# EAGLE schematic tf328 (EAGLE 8.2.2)

## Sheet 1 of 4
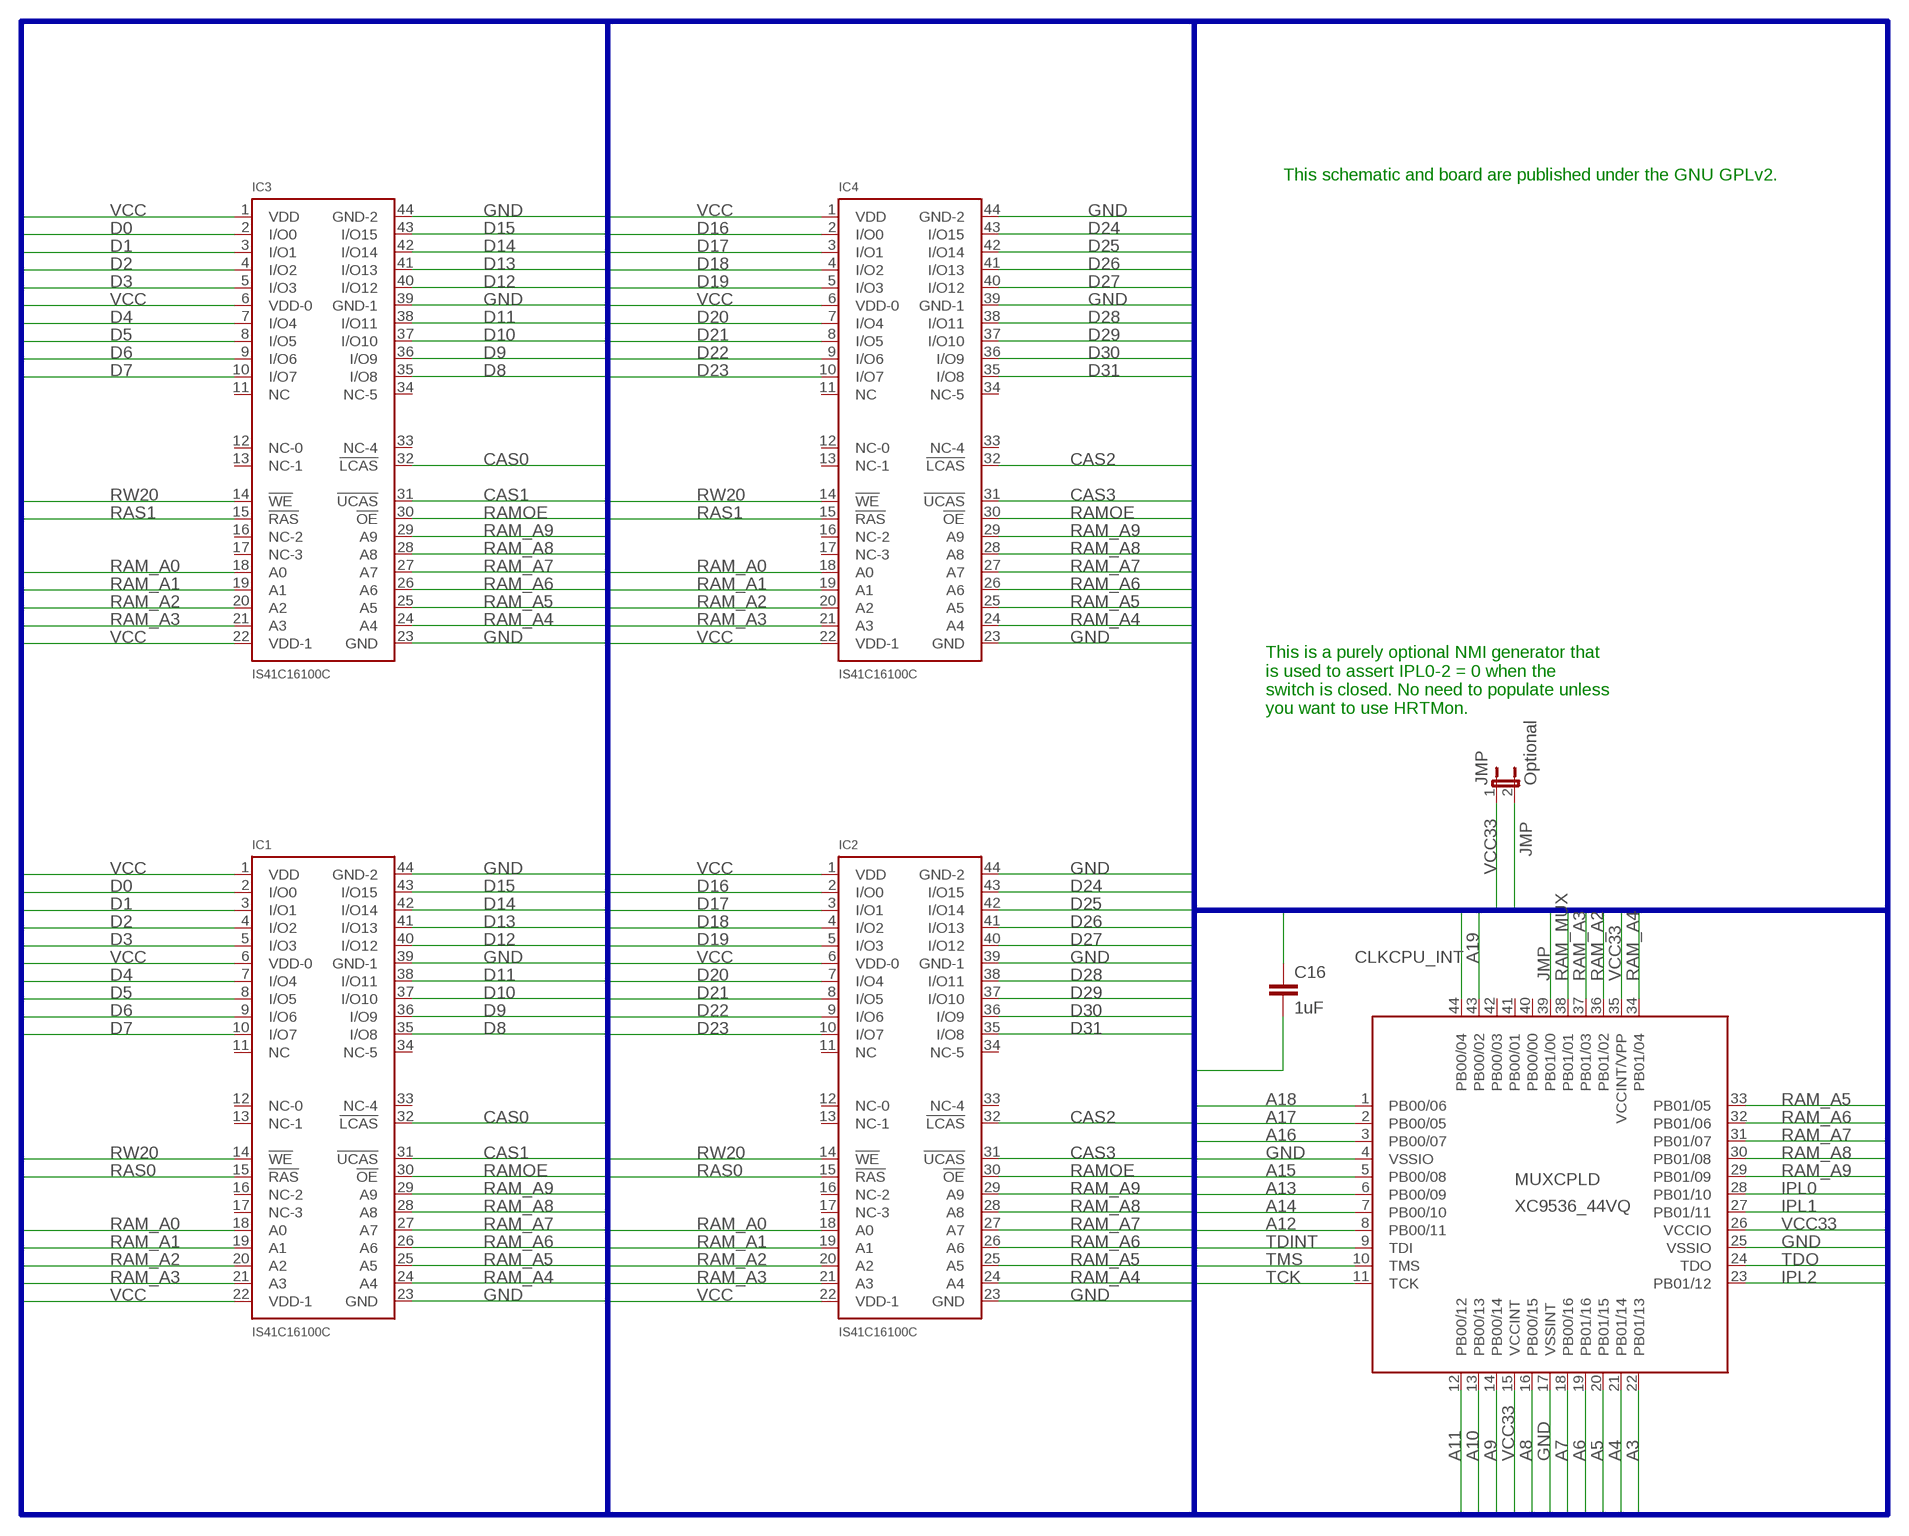
[diagram p0: schematic, sheet 1]

### Parts
C16  1uF  CC0603  [C0603]
IC1  IS41C16100C  [TSOP44(50)-II]
IC2  IS41C16100C  [TSOP44(50)-II]
IC3  IS41C16100C  [TSOP44(50)-II]
IC4  IS41C16100C  [TSOP44(50)-II]
JMP  Optional  JUMPER-2PTH  [1X02]
MUXCPLD  XC9536_44VQ  [SQFP-S-10X10-44]

### Nets
A3: MUXCPLD.22(PB01/13) ; also sheet 2,3,4
A4: MUXCPLD.21(PB01/14) ; also sheet 2,3,4
A5: MUXCPLD.20(PB01/15) ; also sheet 2,4
A6: MUXCPLD.19(PB01/16) ; also sheet 2,4
A7: MUXCPLD.18(PB00/16) ; also sheet 2
A8: MUXCPLD.16(PB00/15) ; also sheet 2
A9: MUXCPLD.14(PB00/14) ; also sheet 2
A10: MUXCPLD.13(PB00/13) ; also sheet 2
A11: MUXCPLD.12(PB00/12) ; also sheet 2
A12: MUXCPLD.8(PB00/11) ; also sheet 2,4
A13: MUXCPLD.6(PB00/09) ; also sheet 2,4
A14: MUXCPLD.7(PB00/10) ; also sheet 2
A15: MUXCPLD.5(PB00/08) ; also sheet 2,4
A16: MUXCPLD.3(PB00/07) ; also sheet 2,4
A17: MUXCPLD.2(PB00/05) ; also sheet 2,4
A18: MUXCPLD.1(PB00/06) ; also sheet 2,4
A19: MUXCPLD.43(PB00/02) ; also sheet 2,4
CAS0: IC1.32(!LCAS) IC3.32(!LCAS) ; also sheet 4
CAS1: IC1.31(!UCAS) IC3.31(!UCAS) ; also sheet 4
CAS2: IC2.32(!LCAS) IC4.32(!LCAS) ; also sheet 4
CAS3: IC2.31(!UCAS) IC4.31(!UCAS) ; also sheet 4
CLKCPU_INT: MUXCPLD.44(PB00/04) ; also sheet 4
D0: IC1.2(I/O0) IC3.2(I/O0) ; also sheet 2
D1: IC1.3(I/O1) IC3.3(I/O1) ; also sheet 2
D2: IC1.4(I/O2) IC3.4(I/O2) ; also sheet 2
D3: IC1.5(I/O3) IC3.5(I/O3) ; also sheet 2
D4: IC1.7(I/O4) IC3.7(I/O4) ; also sheet 2
D5: IC1.8(I/O5) IC3.8(I/O5) ; also sheet 2
D6: IC1.9(I/O6) IC3.9(I/O6) ; also sheet 2
D7: IC1.10(I/O7) IC3.10(I/O7) ; also sheet 2
D8: IC1.35(I/O8) IC3.35(I/O8) ; also sheet 2
D9: IC1.36(I/O9) IC3.36(I/O9) ; also sheet 2
D10: IC1.37(I/O10) IC3.37(I/O10) ; also sheet 2
D11: IC1.38(I/O11) IC3.38(I/O11) ; also sheet 2
D12: IC1.40(I/O12) IC3.40(I/O12) ; also sheet 2
D13: IC1.41(I/O13) IC3.41(I/O13) ; also sheet 2
D14: IC1.42(I/O14) IC3.42(I/O14) ; also sheet 2
D15: IC1.43(I/O15) IC3.43(I/O15) ; also sheet 2
D16: IC2.2(I/O0) IC4.2(I/O0) ; also sheet 2,3
D17: IC2.3(I/O1) IC4.3(I/O1) ; also sheet 2,3
D18: IC2.4(I/O2) IC4.4(I/O2) ; also sheet 2,3
D19: IC2.5(I/O3) IC4.5(I/O3) ; also sheet 2,3
D20: IC2.7(I/O4) IC4.7(I/O4) ; also sheet 2,3
D21: IC2.8(I/O5) IC4.8(I/O5) ; also sheet 2,3
D22: IC2.9(I/O6) IC4.9(I/O6) ; also sheet 2,3
D23: IC2.10(I/O7) IC4.10(I/O7) ; also sheet 2,3
D24: IC2.43(I/O15) IC4.43(I/O15) ; also sheet 2,3,4
D25: IC2.42(I/O14) IC4.42(I/O14) ; also sheet 2,3,4
D26: IC2.41(I/O13) IC4.41(I/O13) ; also sheet 2,3,4
D27: IC2.40(I/O12) IC4.40(I/O12) ; also sheet 2,3,4
D28: IC2.38(I/O11) IC4.38(I/O11) ; also sheet 2,3,4
D29: IC2.37(I/O10) IC4.37(I/O10) ; also sheet 2,3,4
D30: IC2.36(I/O9) IC4.36(I/O9) ; also sheet 2,3,4
D31: IC2.35(I/O8) IC4.35(I/O8) ; also sheet 2,3,4
GND: C16.2 IC1.23(GND) IC1.39(GND-1) IC1.44(GND-2) IC2.23(GND) IC2.39(GND-1) IC2.44(GND-2) IC3.23(GND) IC3.39(GND-1) IC3.44(GND-2) IC4.23(GND) IC4.39(GND-1) IC4.44(GND-2) MUXCPLD.4(VSSIO) MUXCPLD.17(VSSINT) MUXCPLD.25(VSSIO) ; also sheet 2,3,4
IPL0: MUXCPLD.28(PB01/10) ; also sheet 2
IPL1: MUXCPLD.27(PB01/11) ; also sheet 2
IPL2: MUXCPLD.23(PB01/12) ; also sheet 2
JMP: JMP.2 MUXCPLD.39(PB01/00)
RAM_A0: IC1.18(A0) IC2.18(A0) IC3.18(A0) IC4.18(A0) ; also sheet 4
RAM_A1: IC1.19(A1) IC2.19(A1) IC3.19(A1) IC4.19(A1) ; also sheet 4
RAM_A2: IC1.20(A2) IC2.20(A2) IC3.20(A2) IC4.20(A2) MUXCPLD.36(PB01/02)
RAM_A3: IC1.21(A3) IC2.21(A3) IC3.21(A3) IC4.21(A3) MUXCPLD.37(PB01/03)
RAM_A4: IC1.24(A4) IC2.24(A4) IC3.24(A4) IC4.24(A4) MUXCPLD.34(PB01/04)
RAM_A5: IC1.25(A5) IC2.25(A5) IC3.25(A5) IC4.25(A5) MUXCPLD.33(PB01/05)
RAM_A6: IC1.26(A6) IC2.26(A6) IC3.26(A6) IC4.26(A6) MUXCPLD.32(PB01/06)
RAM_A7: IC1.27(A7) IC2.27(A7) IC3.27(A7) IC4.27(A7) MUXCPLD.31(PB01/07)
RAM_A8: IC1.28(A8) IC2.28(A8) IC3.28(A8) IC4.28(A8) MUXCPLD.30(PB01/08)
RAM_A9: IC1.29(A9) IC2.29(A9) IC3.29(A9) IC4.29(A9) MUXCPLD.29(PB01/09)
RAM_MUX: MUXCPLD.38(PB01/01) ; also sheet 4
RAMOE: IC1.30(!OE) IC2.30(!OE) IC3.30(!OE) IC4.30(!OE) ; also sheet 4
RAS0: IC1.15(!RAS) IC2.15(!RAS) ; also sheet 4
RAS1: IC3.15(!RAS) IC4.15(!RAS) ; also sheet 4
RW20: IC1.14(!WE) IC2.14(!WE) IC3.14(!WE) IC4.14(!WE) ; also sheet 2,4
TCK: MUXCPLD.11(TCK) ; also sheet 4
TDINT: MUXCPLD.9(TDI) ; also sheet 4
TDO: MUXCPLD.24(TDO) ; also sheet 4
TMS: MUXCPLD.10(TMS) ; also sheet 4
VCC: IC1.1(VDD) IC1.6(VDD-0) IC1.22(VDD-1) IC2.1(VDD) IC2.6(VDD-0) IC2.22(VDD-1) IC3.1(VDD) IC3.6(VDD-0) IC3.22(VDD-1) IC4.1(VDD) IC4.6(VDD-0) IC4.22(VDD-1) ; also sheet 2,3,4
VCC33: C16.1 JMP.1 MUXCPLD.15(VCCINT) MUXCPLD.26(VCCIO) MUXCPLD.35(VCCINT/VPP) ; also sheet 4
Unconnected: IC1.11(NC) IC1.12(NC-0) IC1.13(NC-1) IC1.16(NC-2) IC1.17(NC-3) IC1.33(NC-4) IC1.34(NC-5) IC2.11(NC) IC2.12(NC-0) IC2.13(NC-1) IC2.16(NC-2) IC2.17(NC-3) IC2.33(NC-4) IC2.34(NC-5) IC3.11(NC) IC3.12(NC-0) IC3.13(NC-1) IC3.16(NC-2) IC3.17(NC-3) IC3.33(NC-4) IC3.34(NC-5) IC4.11(NC) IC4.12(NC-0) IC4.13(NC-1) IC4.16(NC-2) IC4.17(NC-3) IC4.33(NC-4) IC4.34(NC-5) MUXCPLD.40(PB00/00) MUXCPLD.41(PB00/01) MUXCPLD.42(PB00/03)

### Buses
VCC33,VCC,GND,RW20,D[0..31],RAM_A[0..9],RAM_CAS[0..1],RAMOE,A[0..23],RAM_MUX,RAS[0..1],CAS[0..3],TCK,TMS,TDI,TDO,TDINT,CLKCPU_INT,AS20,DS20,IPL[0..2],JMP

### Notes on the sheet
- This schematic and board are published under the GNU GPLv2.
- This is a purely optional NMI generator that 
  is used to assert IPL0-2 = 0 when the
  switch is closed. No need to populate unless
  you want to use HRTMon.

## Sheet 2 of 4
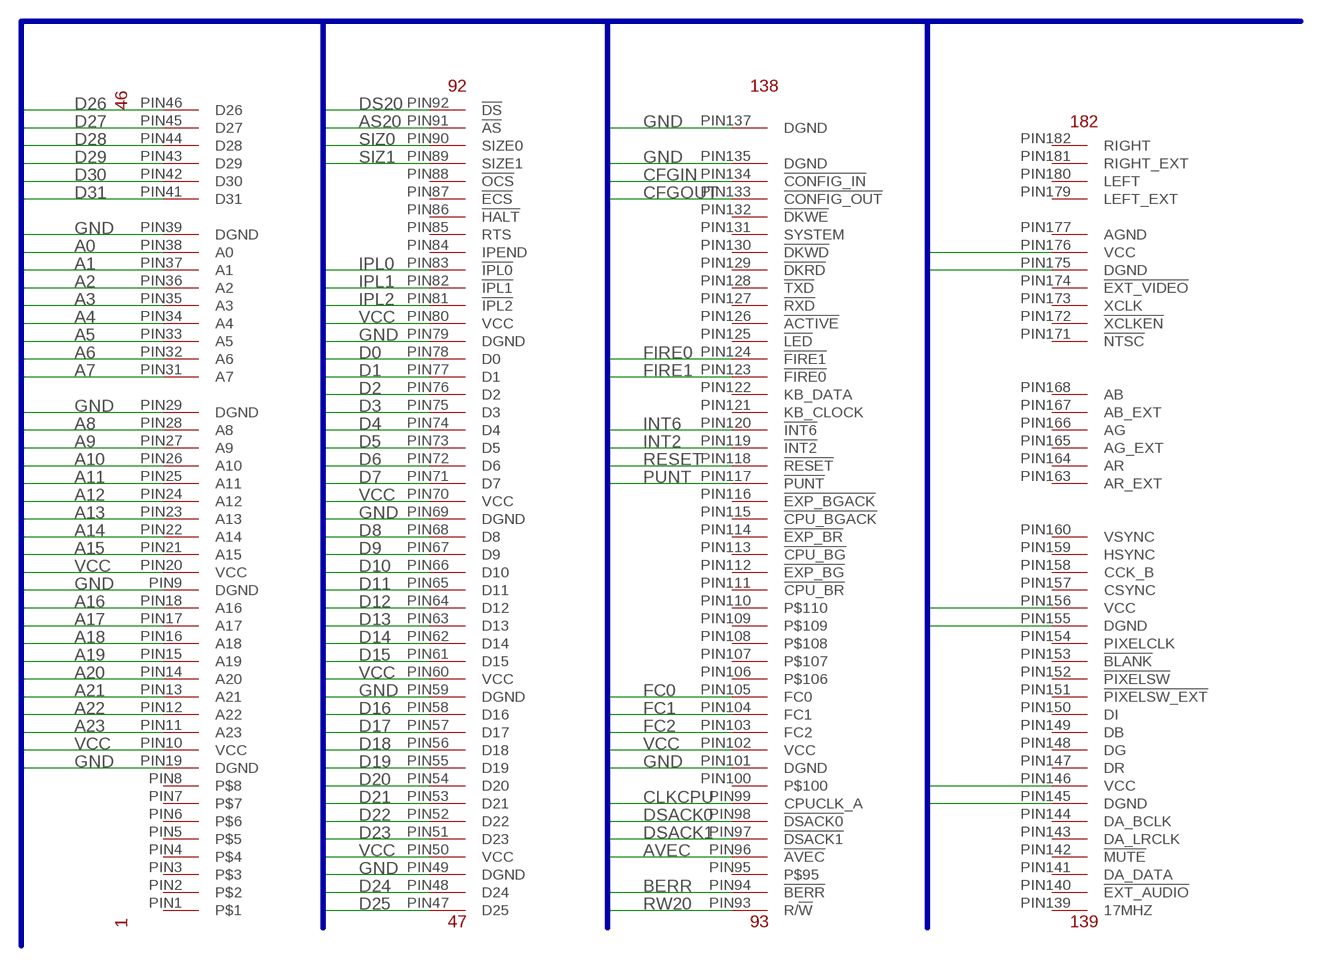
[diagram p1: schematic, sheet 2]

### Parts
CONN1  MCA_CONN_182  [MCA_CONN_182]

### Nets
A0: CONN1.PIN38(A0) ; also sheet 4
A1: CONN1.PIN37(A1) ; also sheet 4
A2: CONN1.PIN36(A2) ; also sheet 3,4
A3: CONN1.PIN35(A3) ; also sheet 1,3,4
A4: CONN1.PIN34(A4) ; also sheet 1,3,4
A5: CONN1.PIN33(A5) ; also sheet 1,4
A6: CONN1.PIN32(A6) ; also sheet 1,4
A7: CONN1.PIN31(A7) ; also sheet 1
A8: CONN1.PIN28(A8) ; also sheet 1
A9: CONN1.PIN27(A9) ; also sheet 1
A10: CONN1.PIN26(A10) ; also sheet 1
A11: CONN1.PIN25(A11) ; also sheet 1
A12: CONN1.PIN24(A12) ; also sheet 1,4
A13: CONN1.PIN23(A13) ; also sheet 1,4
A14: CONN1.PIN22(A14) ; also sheet 1
A15: CONN1.PIN21(A15) ; also sheet 1,4
A16: CONN1.PIN18(A16) ; also sheet 1,4
A17: CONN1.PIN17(A17) ; also sheet 1,4
A18: CONN1.PIN16(A18) ; also sheet 1,4
A19: CONN1.PIN15(A19) ; also sheet 1,4
A20: CONN1.PIN14(A20) ; also sheet 4
A21: CONN1.PIN13(A21) ; also sheet 4
A22: CONN1.PIN12(A22) ; also sheet 4
A23: CONN1.PIN11(A23) ; also sheet 4
AS20: CONN1.PIN91(!AS) ; also sheet 4
AVEC: CONN1.PIN96(!AVEC)
BERR: CONN1.PIN94(!BERR)
CFGIN: CONN1.PIN134(!CONFIG_IN)
CFGOUT: CONN1.PIN133(!CONFIG_OUT)
CLKCPU: CONN1.PIN99(CPUCLK_A) ; also sheet 4
D0: CONN1.PIN78(D0) ; also sheet 1
D1: CONN1.PIN77(D1) ; also sheet 1
D2: CONN1.PIN76(D2) ; also sheet 1
D3: CONN1.PIN75(D3) ; also sheet 1
D4: CONN1.PIN74(D4) ; also sheet 1
D5: CONN1.PIN73(D5) ; also sheet 1
D6: CONN1.PIN72(D6) ; also sheet 1
D7: CONN1.PIN71(D7) ; also sheet 1
D8: CONN1.PIN68(D8) ; also sheet 1
D9: CONN1.PIN67(D9) ; also sheet 1
D10: CONN1.PIN66(D10) ; also sheet 1
D11: CONN1.PIN65(D11) ; also sheet 1
D12: CONN1.PIN64(D12) ; also sheet 1
D13: CONN1.PIN63(D13) ; also sheet 1
D14: CONN1.PIN62(D14) ; also sheet 1
D15: CONN1.PIN61(D15) ; also sheet 1
D16: CONN1.PIN58(D16) ; also sheet 1,3
D17: CONN1.PIN57(D17) ; also sheet 1,3
D18: CONN1.PIN56(D18) ; also sheet 1,3
D19: CONN1.PIN55(D19) ; also sheet 1,3
D20: CONN1.PIN54(D20) ; also sheet 1,3
D21: CONN1.PIN53(D21) ; also sheet 1,3
D22: CONN1.PIN52(D22) ; also sheet 1,3
D23: CONN1.PIN51(D23) ; also sheet 1,3
D24: CONN1.PIN48(D24) ; also sheet 1,3,4
D25: CONN1.PIN47(D25) ; also sheet 1,3,4
D26: CONN1.PIN46(D26) ; also sheet 1,3,4
D27: CONN1.PIN45(D27) ; also sheet 1,3,4
D28: CONN1.PIN44(D28) ; also sheet 1,3,4
D29: CONN1.PIN43(D29) ; also sheet 1,3,4
D30: CONN1.PIN42(D30) ; also sheet 1,3,4
D31: CONN1.PIN41(D31) ; also sheet 1,3,4
DS20: CONN1.PIN92(!DS) ; also sheet 4
DSACK0: CONN1.PIN98(!DSACK0) ; also sheet 4
DSACK1: CONN1.PIN97(!DSACK1) ; also sheet 4
FC0: CONN1.PIN105(FC0)
FC1: CONN1.PIN104(FC1)
FC2: CONN1.PIN103(FC2)
FIRE0: CONN1.PIN124(!FIRE1)
FIRE1: CONN1.PIN123(!FIRE0)
GND: CONN1.PIN9(DGND) CONN1.PIN19(DGND) CONN1.PIN29(DGND) CONN1.PIN39(DGND) CONN1.PIN49(DGND) CONN1.PIN59(DGND) CONN1.PIN69(DGND) CONN1.PIN79(DGND) CONN1.PIN101(DGND) CONN1.PIN135(DGND) CONN1.PIN137(DGND) CONN1.PIN145(DGND) CONN1.PIN155(DGND) CONN1.PIN175(DGND) ; also sheet 1,3,4
INT2: CONN1.PIN119(!INT2) ; also sheet 4
INT6: CONN1.PIN120(!INT6)
IPL0: CONN1.PIN83(!IPL0) ; also sheet 1
IPL1: CONN1.PIN82(!IPL1) ; also sheet 1
IPL2: CONN1.PIN81(!IPL2) ; also sheet 1
PUNT: CONN1.PIN117(!PUNT) ; also sheet 4
RESET: CONN1.PIN118(!RESET) ; also sheet 3,4
RW20: CONN1.PIN93(R/!W) ; also sheet 1,4
SIZ0: CONN1.PIN90(SIZE0) ; also sheet 4
SIZ1: CONN1.PIN89(SIZE1) ; also sheet 4
VCC: CONN1.PIN10(VCC) CONN1.PIN20(VCC) CONN1.PIN50(VCC) CONN1.PIN60(VCC) CONN1.PIN70(VCC) CONN1.PIN80(VCC) CONN1.PIN102(VCC) CONN1.PIN146(VCC) CONN1.PIN156(VCC) CONN1.PIN176(VCC) ; also sheet 1,3,4
Unconnected: CONN1.PIN1 CONN1.PIN2 CONN1.PIN3 CONN1.PIN4 CONN1.PIN5 CONN1.PIN6 CONN1.PIN7 CONN1.PIN8 CONN1.PIN84(IPEND) CONN1.PIN85(RTS) CONN1.PIN86(!HALT) CONN1.PIN87(!ECS) CONN1.PIN88(!OCS) CONN1.PIN95 CONN1.PIN100 CONN1.PIN106 CONN1.PIN107 CONN1.PIN108 CONN1.PIN109 CONN1.PIN110 CONN1.PIN111(!CPU_BR) CONN1.PIN112(!EXP_BG) CONN1.PIN113(!CPU_BG) CONN1.PIN114(!EXP_BR) CONN1.PIN115(!CPU_BGACK) CONN1.PIN116(!EXP_BGACK) CONN1.PIN121(KB_CLOCK) CONN1.PIN122(KB_DATA) CONN1.PIN125(!LED) CONN1.PIN126(!ACTIVE) CONN1.PIN127(!RXD) CONN1.PIN128(!TXD) CONN1.PIN129(!DKRD) CONN1.PIN130(!DKWD) CONN1.PIN131(SYSTEM) CONN1.PIN132(!DKWE) CONN1.PIN139(17MHZ) CONN1.PIN140(!EXT_AUDIO) CONN1.PIN141(DA_DATA) CONN1.PIN142(!MUTE) CONN1.PIN143(DA_LRCLK) CONN1.PIN144(DA_BCLK) CONN1.PIN147(DR) CONN1.PIN148(DG) CONN1.PIN149(DB) CONN1.PIN150(DI) CONN1.PIN151(!PIXELSW_EXT) CONN1.PIN152(!PIXELSW) CONN1.PIN153(!BLANK) CONN1.PIN154(PIXELCLK) CONN1.PIN157(CSYNC) CONN1.PIN158(CCK_B) CONN1.PIN159(HSYNC) CONN1.PIN160(VSYNC) CONN1.PIN163(AR_EXT) CONN1.PIN164(AR) CONN1.PIN165(AG_EXT) CONN1.PIN166(AG) CONN1.PIN167(AB_EXT) CONN1.PIN168(AB) CONN1.PIN171(!NTSC) CONN1.PIN172(!XCLKEN) CONN1.PIN173(XCLK) CONN1.PIN174(!EXT_VIDEO) CONN1.PIN179(LEFT_EXT) CONN1.PIN180(LEFT) CONN1.PIN181(RIGHT_EXT) CONN1.PIN182(RIGHT)

### Buses
VCC,GND,D[0..31],A[0..31],INT2,INT6,RESET,AS20,DS20,RW20,SIZ[0..1],DSACK[0..1],FC[0..2],CLKCPU,AVEC,BERR,CFGIN,CFGOUT,PUNT,FIRE[0..1],IPL[0..2]

## Sheet 3 of 4
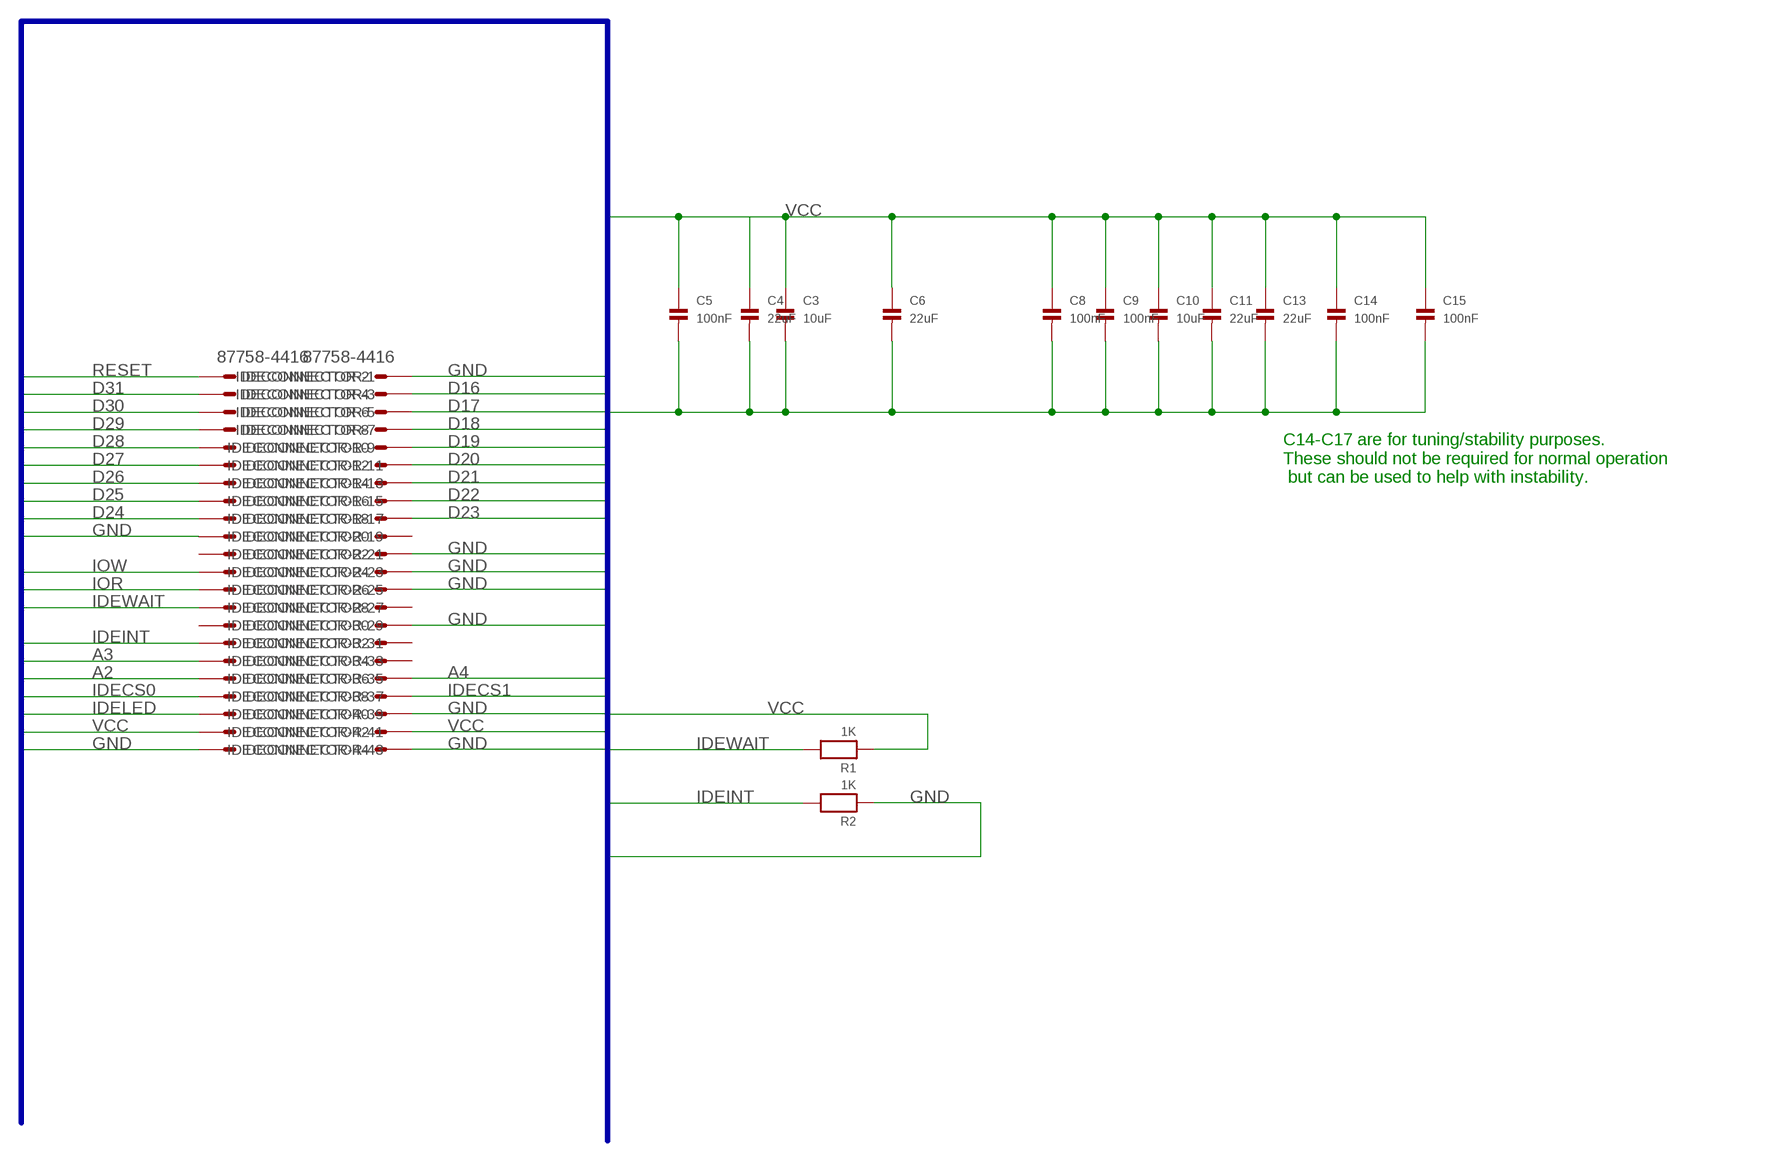
[diagram p2: schematic, sheet 3]

### Parts
C3  10uF  CAP_CERAMIC1206  [1206]
C4  22uF  CAP_CERAMIC1206  [1206]
C5  100nF  CAP_CERAMIC1206  [1206]
C6  22uF  CAP_CERAMIC1206  [1206]
C8  100nF  CAP_CERAMIC1206  [1206]
C9  100nF  CAP_CERAMIC1206  [1206]
C10  10uF  CAP_CERAMIC1206  [1206]
C11  22uF  CAP_CERAMIC1206  [1206]
C13  22uF  CAP_CERAMIC1206  [1206]
C14  100nF  CAP_CERAMIC1206  [1206]
C15  100nF  CAP_CERAMIC1206  [1206]
IDECONNECTOR  87758-4416  [87758-4416]
R1  1K  RESISTOR1206  [1206]
R2  1K  RESISTOR1206  [1206]

### Nets
A2: IDECONNECTOR.35 ; also sheet 2,4
A3: IDECONNECTOR.33 ; also sheet 1,2,4
A4: IDECONNECTOR.36 ; also sheet 1,2,4
D16: IDECONNECTOR.4 ; also sheet 1,2
D17: IDECONNECTOR.6 ; also sheet 1,2
D18: IDECONNECTOR.8 ; also sheet 1,2
D19: IDECONNECTOR.10 ; also sheet 1,2
D20: IDECONNECTOR.12 ; also sheet 1,2
D21: IDECONNECTOR.14 ; also sheet 1,2
D22: IDECONNECTOR.16 ; also sheet 1,2
D23: IDECONNECTOR.18 ; also sheet 1,2
D24: IDECONNECTOR.17 ; also sheet 1,2,4
D25: IDECONNECTOR.15 ; also sheet 1,2,4
D26: IDECONNECTOR.13 ; also sheet 1,2,4
D27: IDECONNECTOR.11 ; also sheet 1,2,4
D28: IDECONNECTOR.9 ; also sheet 1,2,4
D29: IDECONNECTOR.7 ; also sheet 1,2,4
D30: IDECONNECTOR.5 ; also sheet 1,2,4
D31: IDECONNECTOR.3 ; also sheet 1,2,4
GND: C3.2 C4.2 C5.2 C6.2 C8.2 C9.2 C10.2 C11.2 C13.2 C14.2 C15.2 IDECONNECTOR.2 IDECONNECTOR.19 IDECONNECTOR.22 IDECONNECTOR.24 IDECONNECTOR.26 IDECONNECTOR.30 IDECONNECTOR.40 IDECONNECTOR.43 IDECONNECTOR.44 R2.1 ; also sheet 1,2,4
IDECS0: IDECONNECTOR.37 ; also sheet 4
IDECS1: IDECONNECTOR.38 ; also sheet 4
IDEINT: IDECONNECTOR.31 R2.2 ; also sheet 4
IDELED: IDECONNECTOR.39
IDEWAIT: IDECONNECTOR.27 R1.2
IOR: IDECONNECTOR.25 ; also sheet 4
IOW: IDECONNECTOR.23 ; also sheet 4
RESET: IDECONNECTOR.1 ; also sheet 2,4
VCC: C3.1 C4.1 C5.1 C6.1 C8.1 C9.1 C10.1 C11.1 C13.1 C14.1 C15.1 IDECONNECTOR.41 IDECONNECTOR.42 R1.1 ; also sheet 1,2,4
Unconnected: IDECONNECTOR.20 IDECONNECTOR.21 IDECONNECTOR.28 IDECONNECTOR.29 IDECONNECTOR.32 IDECONNECTOR.34

### Buses
VCC33,VCC,GND,CLK7M,A[0..31],D[0..31],IPL[0..2],FC[0..2],DSACK[0..1],BR,BGACK,RW20,CLKCPU,CLKCPU_INT,AS20,DS20,BG20,AVEC,SIZ[0..1],DBEN,BERR,RESET,HALT,BG,VPA,VMA,E,AS,UDS,LDS,DTACK,CPCS,CPSENSE,CDIS,MMUDIS,IOR,IOW,INT2,IDECS[0..1],IDELED,IDEWAIT,IDEINT,RAMOE,RAMCS[0..3],INTSIG[0..4],TCK,TMS,TDI,TDO,TDINT,RAM_MUX

### Notes on the sheet
- C14-C17 are for tuning/stability purposes. 
  These should not be required for normal operation
   but can be used to help with instability.

## Sheet 4 of 4
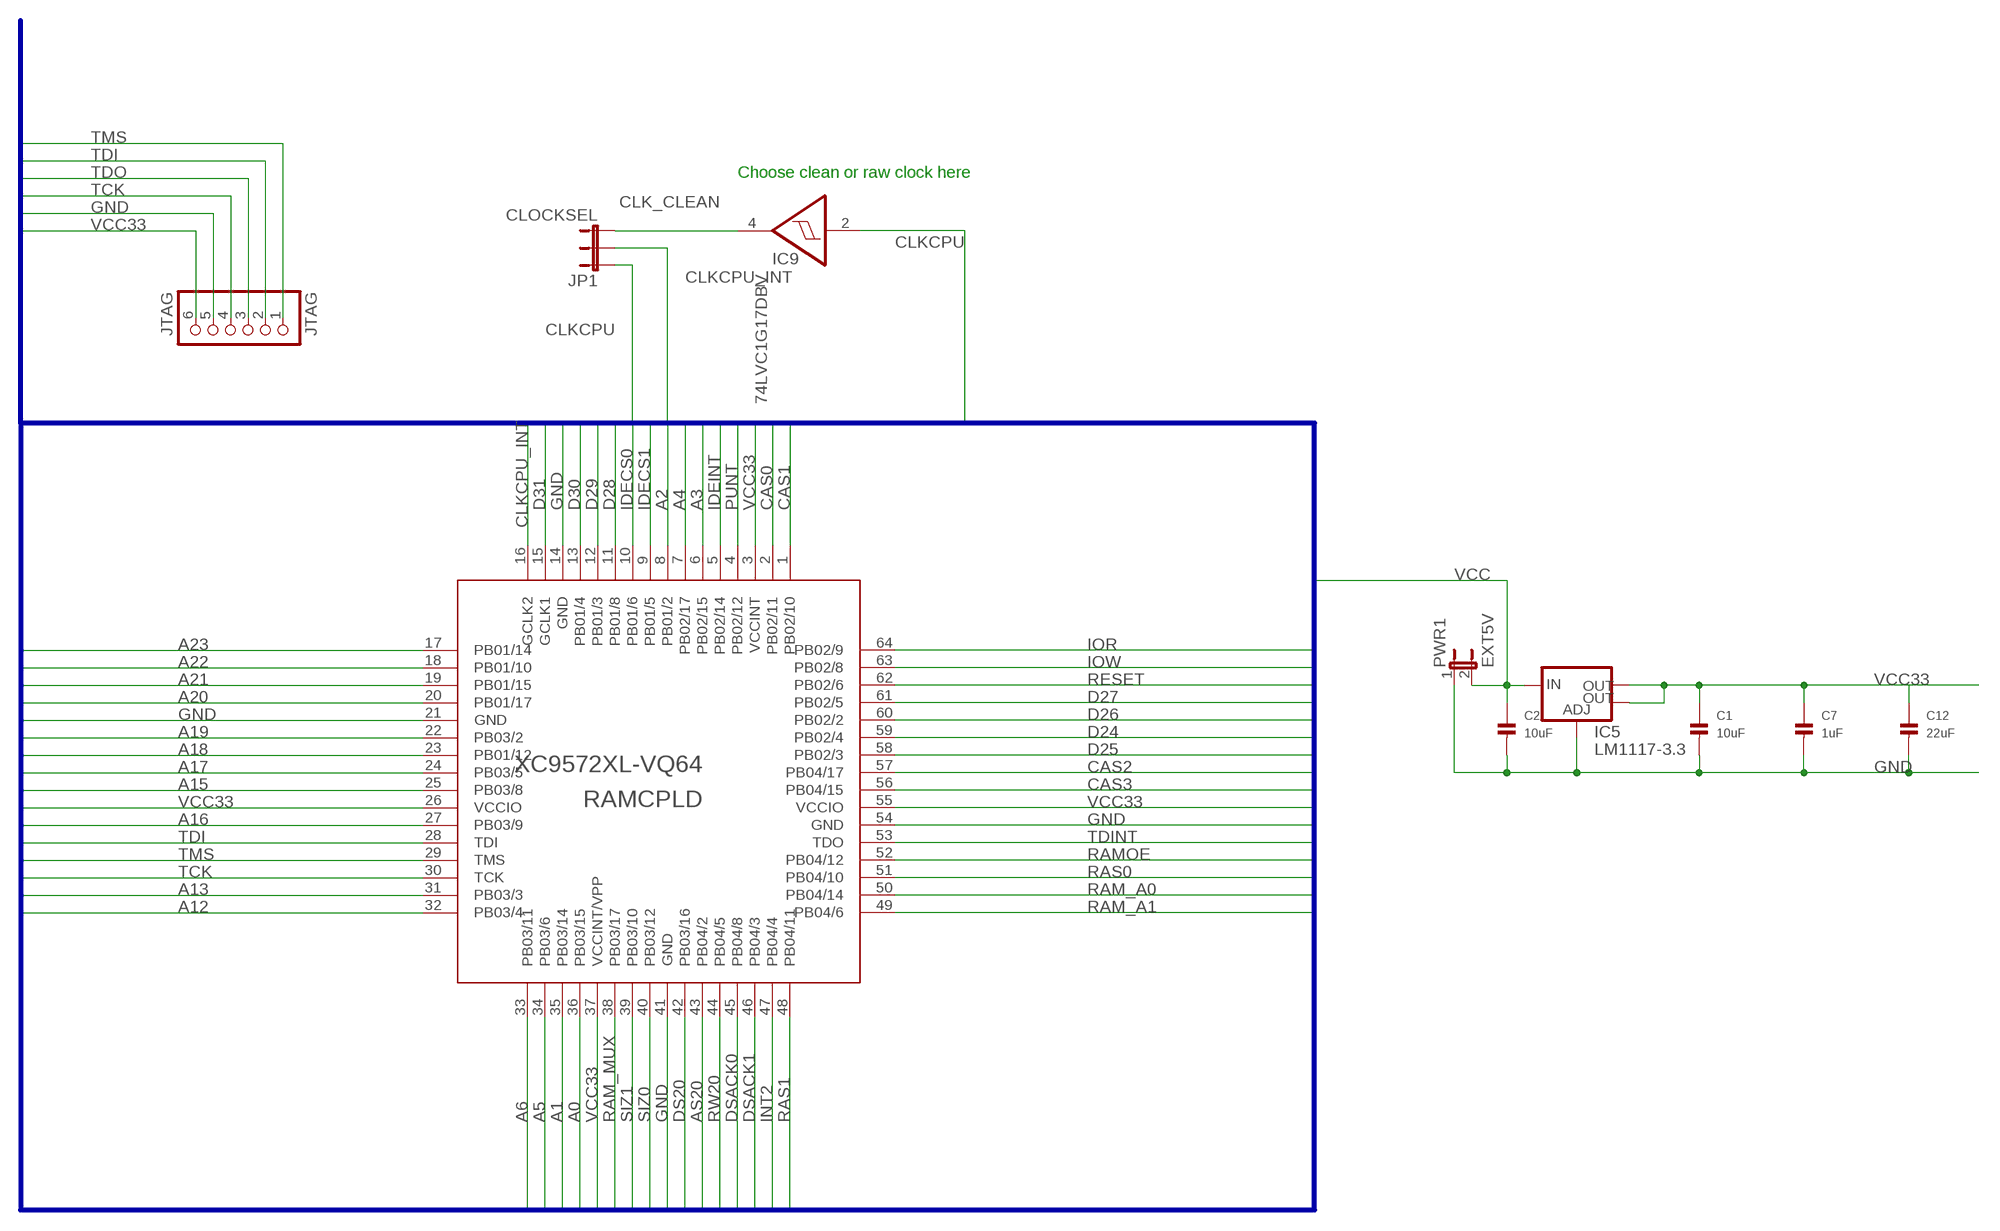
[diagram p3: schematic, sheet 4]

### Parts
C1  10uF  CAP_CERAMIC1206  [1206]
C2  10uF  CAP_CERAMIC1206  [1206]
C7  1uF  CAP_CERAMIC1206  [1206]
C12  22uF  CAP_CERAMIC1206  [1206]
IC5  LM1117-3.3  V_REG_LM1117SOT223  [SOT223]
IC9  74LVC1G17DBV  [SOT23-5]
JP1  CLOCKSEL  JUMPER-3PTH  [1X03]
JTAG  JTAG  HEADER-1X6ROUND  [1X06_ROUND]
PWR1  EXT5V  JUMPER-2PTH  [1X02]
RAMCPLD  XC9572XL-VQ64  [VQ64]

### Nets
A0: RAMCPLD.36(PB03/15) ; also sheet 2
A1: RAMCPLD.35(PB03/14) ; also sheet 2
A2: RAMCPLD.8(PB01/2) ; also sheet 2,3
A3: RAMCPLD.6(PB02/15) ; also sheet 1,2,3
A4: RAMCPLD.7(PB02/17) ; also sheet 1,2,3
A5: RAMCPLD.34(PB03/6) ; also sheet 1,2
A6: RAMCPLD.33(PB03/11) ; also sheet 1,2
A12: RAMCPLD.32(PB03/4) ; also sheet 1,2
A13: RAMCPLD.31(PB03/3) ; also sheet 1,2
A15: RAMCPLD.25(PB03/8) ; also sheet 1,2
A16: RAMCPLD.27(PB03/9) ; also sheet 1,2
A17: RAMCPLD.24(PB03/5) ; also sheet 1,2
A18: RAMCPLD.23(PB01/12) ; also sheet 1,2
A19: RAMCPLD.22(PB03/2) ; also sheet 1,2
A20: RAMCPLD.20(PB01/17) ; also sheet 2
A21: RAMCPLD.19(PB01/15) ; also sheet 2
A22: RAMCPLD.18(PB01/10) ; also sheet 2
A23: RAMCPLD.17(PB01/14) ; also sheet 2
AS20: RAMCPLD.43(PB04/2) ; also sheet 2
CAS0: RAMCPLD.2(PB02/11) ; also sheet 1
CAS1: RAMCPLD.1(PB02/10) ; also sheet 1
CAS2: RAMCPLD.57(PB04/17) ; also sheet 1
CAS3: RAMCPLD.56(PB04/15) ; also sheet 1
CLK_CLEAN: IC9.4(O) JP1.3
CLKCPU: IC9.2(I) JP1.1 ; also sheet 2
CLKCPU_INT: JP1.2 RAMCPLD.16(GCLK2) ; also sheet 1
D24: RAMCPLD.59(PB02/4) ; also sheet 1,2,3
D25: RAMCPLD.58(PB02/3) ; also sheet 1,2,3
D26: RAMCPLD.60(PB02/2) ; also sheet 1,2,3
D27: RAMCPLD.61(PB02/5) ; also sheet 1,2,3
D28: RAMCPLD.11(PB01/8) ; also sheet 1,2,3
D29: RAMCPLD.12(PB01/3) ; also sheet 1,2,3
D30: RAMCPLD.13(PB01/4) ; also sheet 1,2,3
D31: RAMCPLD.15(GCLK1) ; also sheet 1,2,3
DS20: RAMCPLD.42(PB03/16) ; also sheet 2
DSACK0: RAMCPLD.45(PB04/8) ; also sheet 2
DSACK1: RAMCPLD.46(PB04/3) ; also sheet 2
GND: C1.2 C2.2 C7.2 C12.2 IC5.1(ADJ) JTAG.5 PWR1.1 RAMCPLD.14(GND) RAMCPLD.21(GND) RAMCPLD.41(GND) RAMCPLD.54(GND) ; also sheet 1,2,3
IDECS0: RAMCPLD.10(PB01/6) ; also sheet 3
IDECS1: RAMCPLD.9(PB01/5) ; also sheet 3
IDEINT: RAMCPLD.5(PB02/14) ; also sheet 3
INT2: RAMCPLD.47(PB04/4) ; also sheet 2
IOR: RAMCPLD.64(PB02/9) ; also sheet 3
IOW: RAMCPLD.63(PB02/8) ; also sheet 3
PUNT: RAMCPLD.4(PB02/12) ; also sheet 2
RAM_A0: RAMCPLD.50(PB04/14) ; also sheet 1
RAM_A1: RAMCPLD.49(PB04/6) ; also sheet 1
RAM_MUX: RAMCPLD.38(PB03/17) ; also sheet 1
RAMOE: RAMCPLD.52(PB04/12) ; also sheet 1
RAS0: RAMCPLD.51(PB04/10) ; also sheet 1
RAS1: RAMCPLD.48(PB04/11) ; also sheet 1
RESET: RAMCPLD.62(PB02/6) ; also sheet 2,3
RW20: RAMCPLD.44(PB04/5) ; also sheet 1,2
SIZ0: RAMCPLD.40(PB03/12) ; also sheet 2
SIZ1: RAMCPLD.39(PB03/10) ; also sheet 2
TCK: JTAG.4 RAMCPLD.30(TCK) ; also sheet 1
TDI: JTAG.2 RAMCPLD.28(TDI)
TDINT: RAMCPLD.53(TDO) ; also sheet 1
TDO: JTAG.3 ; also sheet 1
TMS: JTAG.1 RAMCPLD.29(TMS) ; also sheet 1
VCC: C2.1 IC5.3(IN) PWR1.2 ; also sheet 1,2,3
VCC33: C1.1 C7.1 C12.1 IC5.2(OUT) IC5.4(OUT) JTAG.6 RAMCPLD.3(VCCINT) RAMCPLD.26(VCCIO) RAMCPLD.37(VCCINT/VPP) RAMCPLD.55(VCCIO) ; also sheet 1

### Buses
VCC33,VCC,GND,CLK7M,A[0..31],D[0..31],IPL[0..2],FC[0..2],DSACK[0..1],BR,BGACK,RW20,CLKCPU,CLKCPU_INT,AS20,DS20,BG20,AVEC,SIZ[0..1],DBEN,BERR,RESET,HALT,BG,VPA,VMA,E,AS,UDS,LDS,DTACK,CPCS,CPSENSE,CDIS,MMUDIS,IOR,IOW,INT2,IDECS[0..1],IDELED,IDEWAIT,IDEINT,RAMOE,RAMCS[0..3],INTSIG[0..4],TCK,TMS,TDI,TDO,TDINT,RAM_MUX,RAM_A[0..9],RAS[0..1],CAS[0..3],RTC_CS,SPARE_CS,INT6,PUNT

### Notes on the sheet
- Choose clean or raw clock here

## Power pins joined to a net without a drawn wire
AGND: CONN1.PIN177(AGND)
GND: IC9.3(GND)
VCC: IC9.5(VCC)

## Library data of the parts
C1-C15 = microbuilder:CAP_CERAMIC: Ceramic Capacitors 0402 - 0402 Surface Mount Capacitors 16pF 50V 5% [Digikey: 445-4899-2-ND] 18pF 50V 5% [Digikey: 490-1281-2-ND] 22pF 50V 5% [Digikey: 490-1283-2-ND] 68pF 50V 5% [Digikey: 490-1289-2-ND] 0.1uF 10V 10% [Digikey: 490-1318-2-ND] 1.0uF 6.3V 10% [Digikey: 490-1320-2-ND] 0603 - 0603 Surface Mount Capacitors 16 pF 50V 5% [Digikey: 445-5051-2-ND] 22 pF 50V [Digikey: PCC220ACVTR-ND] 33 pF 50V 5% [Digikey: 490-1415-1-ND] 56pF 50V 5% [Digikey: 490-1421-1-ND] 220pF 50V 5% [Digikey: 445-1285-1-ND] 680 pF 50V 2200 pF 50V 5% C0G [Digikey: 445-1297-1-ND] 5600 pF 100V 5% X7R [Digikey: 478-3711-1-ND] 0.1 µF 25V 10% [Digikey: PCC2277TR-ND] 0.22 µF 16V 10% X7R [Digikey: 445-1318-1-ND] 1.0 µF 25V 10% [Digikey: 445-5146-2-ND] 0603 - RF Specific 3pF 250V +/-0.1pF RF [Digikey: 712-1347-1-ND] 18 pF 250V 5% [Digikey: 478-3505-1-ND or 712-1322-1-ND] 56 pF 250V 5% C0G RF [Digikey: 490-4867-1-ND] 68 pF 250V RF [Digikey: 490-4868-1-ND] 0805 - 0805 Surface Mount Capacitors 220 pF 250V 2% RF Ceramic Capacitor [Digikey: 712-1398-1-ND] 1000 pF 50V 2% NP0 Ceramic Capacitor [Digikey: 478-3760-1-ND] 0.1 µF 25V 10% Ceramic Capacitor [Digikey: PCC1828TR-ND] 1.0 µF 16V 10% Ceramic Capacitor[Digikey: 490-1691-2-ND] 10.0 µF 10V 10% Ceramic Capacitor[Digikey: 709-1228-1-ND] 10.0 uF 16V 10% Ceramic Capacitor [Digikey: 478-5165-2-ND] 47 uF 6.3V 20% Ceramic Capacitor [Digikey: 587-1779-1-ND or 399-5506-1-ND] 1206 - 1206 Surface Mount Capacitors 47uF 10V 20% Ceramic Capacitor [Digikey: 490-5528-1-ND or 399-5508-1-ND or 445-6010-1-ND] 100uF 6.3V -20%, +80% Y5V Ceramic Capacitor (Digikey: 490-4512-1-ND, Mouser: 81-GRM31CF50J107ZE1L)
C16 = eagle-ltspice:C: CAPACITOR, European symbol; SPICEMODEL: NONE; SPICEPREFIX: C
CONN1 = Hermes_development:MCA_CONN_182
IC1-IC4 = IS41C16100C:IS41C16100C
IC5 = SparkFun-PowerIC:V_REG_LM1117: Voltage Regulator LM1117 Standard adjustable voltage regulator but in SMD form. Spark Fun Electronics SKU : COM-00595; PROD_ID: VREG-08170
IC9 = 74xx-little-de:74*1G17: Single Schmitt-Trigger Buffer
IDECONNECTOR = Hermes_development:87758-4416: 44 Pin - 2mm Dual Row Single Wafer, Vertical T/H HDR Source: http://www.molex.com/pdm_docs/sd/877580616_sd.pdf; MF: MOLEX; MPN: 87758-4416; OC_FARNELL: unknown; OC_NEWARK: 59J1588
JMP PWR1 = SparkFun-Retired:JUMPER-2: Jumper Basic 0.1" spaced jumper. Use with breakaway headers.
JP1 = SparkFun-Retired:JUMPER-3
JTAG = microbuilder:HEADER-1X6: PIN HEADER
MUXCPLD = xilinx-xc9:XC9536_44VQ: xc9536_pc44 XC9500 In-System Programmable CPLD Family Auto generated by make-symbol-device-package-bsdl.ulp Rev. 34 Source: xc9536_vq44.bsd; MPN: XC9536-15VQG44C; OC_FARNELL: 1193227; OC_NEWARK: 98K3377
R1 R2 = microbuilder:RESISTOR: Resistors 0402 - 0402 Surface Mount Package 22 Ohm 1% 1/16W [Digikey: 311-22.0LRTR-ND] 33 Ohm 5% 1/16W 1.0K 5% 1/16W 1.5K 5% 1/16W 2.0K 1% 1/16W 10.0K 1% 1/16W [Digikey: 311-10.0KLRTR-ND] 10.0K 5% 1/16W [Digikey: RMCF0402JT10K0TR-ND] 12.1K 1% 1/16W [Digikey: 311-22.0LRTR-ND] 100.0K 5% 1/16W 0603 - 0603 Surface Mount Package 0 Ohm 1/10 Watt 1% Resistor 15 Ohm 1/10 Watt 1% Resistor 33 Ohm 1/10 Watt 1% Resistor 49.9 Ohm 1/10 Watt 1% Resistor 100 Ohm 1/10 Watt 1% Resistor 150 Ohm 1/10 Watt 1% Resistor 240 Ohm 1/10 Watt 1% Resistor 390 Ohm 1/10 Watt 1% Resistor 560 Ohm 1/10 Watt 1% Resistor 680 Ohm 1/10 Watt 1% Resistor 750 Ohm 1/10 Watt 1% Resistor 1.0K Ohm 1/10 Watt 1% Resistor 1.5K Ohm 1/10 Watt 1% Resistor 2.0K Ohm 1/10 Watt 1% Resistor 2.2K Ohm 1/10 Watt 1% Resistor 3.3K Ohm 1/10 Watt 1% Resistor 4.7K Ohm 1/10 Watt 1% Resistor 10.0K Ohm 1/10 Watt 1% Resistor 12.0K Ohm 1/10 Watt 1% Resistor 12.1K Ohm 1/10 Watt 1% Resistor 20.0K Ohm 1/10 Watt 1% Resistor 33.0K Ohm 1/10 Watt 1% Resistor 100.0K Ohm 1/10 Watt 1% Resistor 0805 - 0805 Surface Mount Package 0 Ohm 1/8 Watt 1% Resistor 33 Ohm 1/8 Watt 1% Resistor 100 Ohm 1/8 Watt 1% Resistor 150 Ohm 1/8 Watt 1% Resistor 200 Ohm 1/8 Watt 1% Resistor 240 Ohm 1/8 Watt 1% Resistor 330 Ohm 1/8 Watt 1% Resistor 390 Ohm 1/8 Watt 1% Resistor 470 Ohm 1/8 Watt 1% Resistor 1.0K Ohm 1/8 Watt 1% Resistor 1.5K Ohm 1/8 Watt 1% Resistor 2.0K Ohm 1/8 Watt 1% Resistor 4.7K Ohm 1/8 Watt 1% Resistor 5.1K Ohm 1/8 Watt 1% Resistor 5.6K Ohm 1/8 Watt 1% Resistor 10.0K Ohm 1/8 Watt 1% Resistor 22.0K Ohm 1/8 Watt 1% Resistor 33.0K Ohm 1/8 Watt 1% Resistor 100K Ohm 1/8 Watt 1% Resistor 1206 - 1206 Surface Mount Package 2012 - 2010 Surface Mount Package 0.11 Ohm 1/2 Watt 1% Resistor - Digikey: RHM.11UCT-ND
RAMCPLD = terriblefire:XC9572XL-VQ64